# EAGLE design THW_Schematic_v1.0.0 (EAGLE 9.1.3)

## Sheet 1 of 2
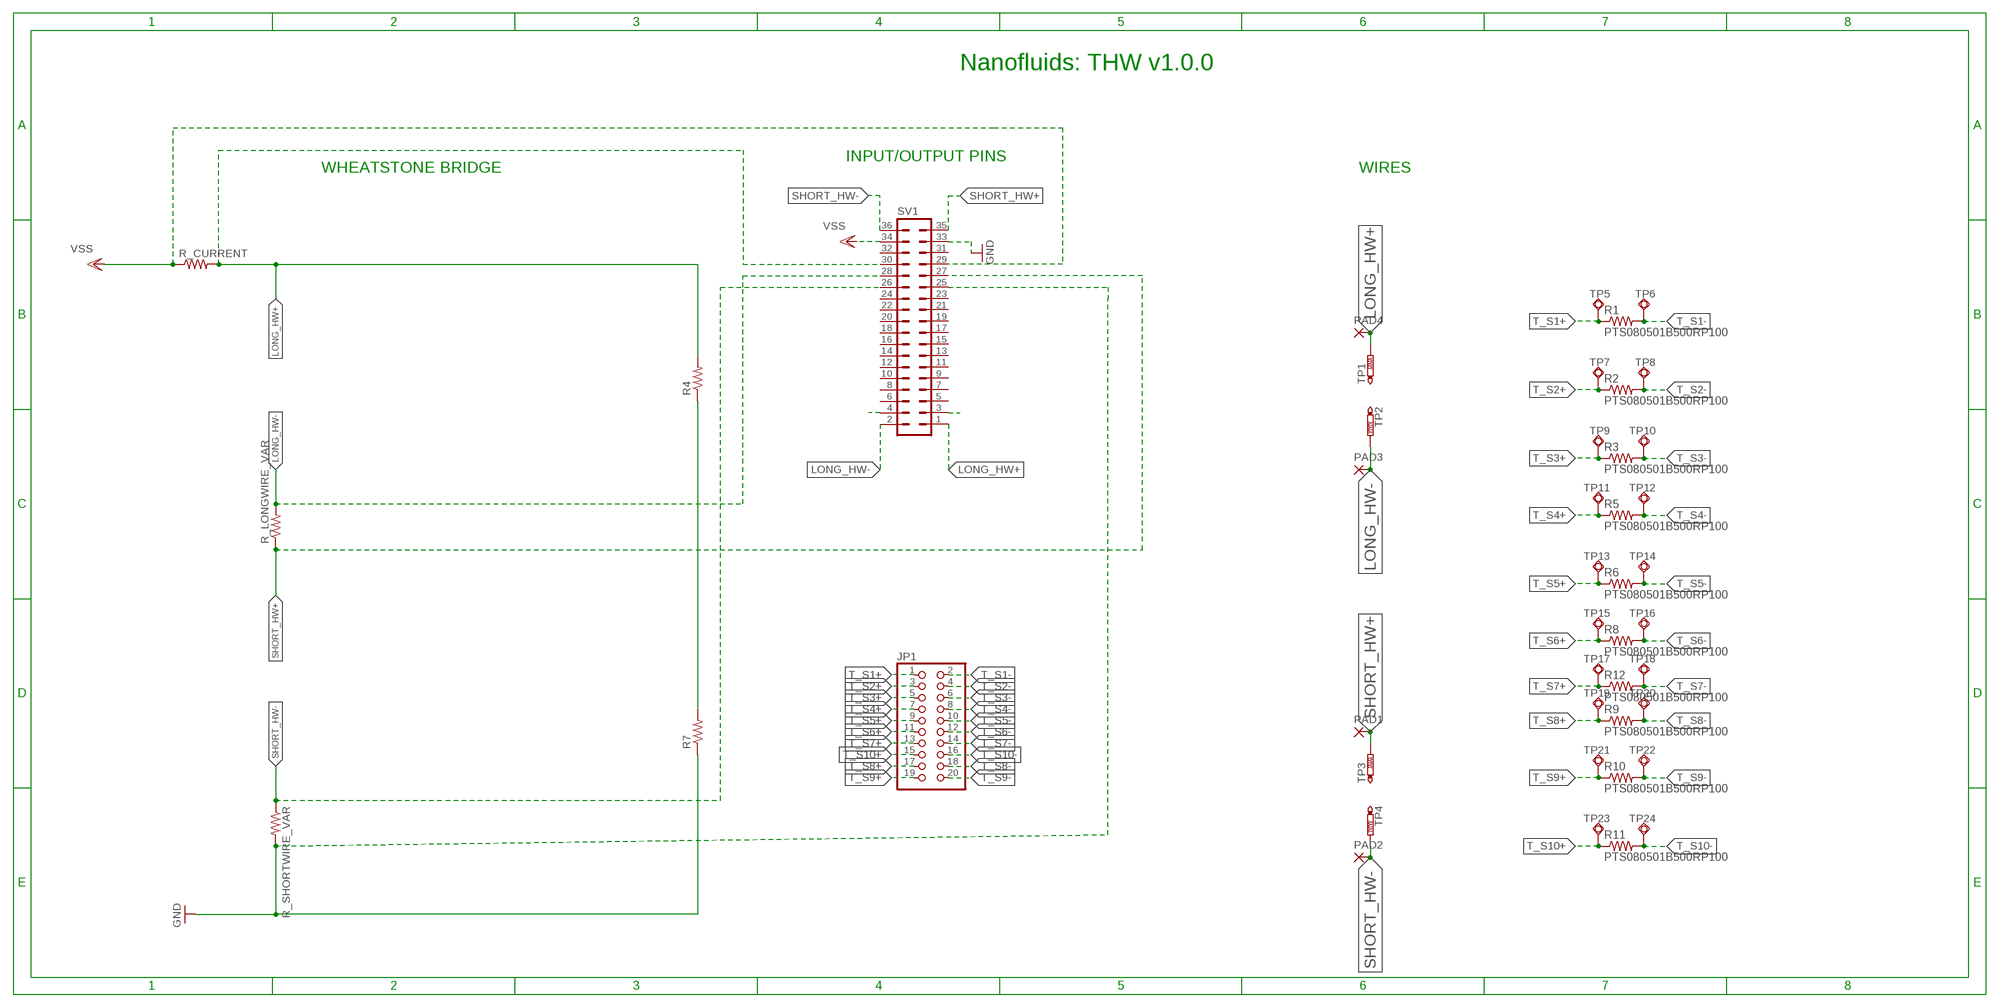
[diagram p0: schematic, sheet 1]

### Parts
JP1  PINHD-2X10  [2X10]
PAD1  SMD5  [SMD2,54-5,08]
PAD2  SMD5  [SMD2,54-5,08]
PAD3  SMD5  [SMD2,54-5,08]
PAD4  SMD5  [SMD2,54-5,08]
R1  PTS080501B500RP100  [RESC2012X60]
R2  PTS080501B500RP100  [RESC2012X60]
R3  PTS080501B500RP100  [RESC2012X60]
R4  R-US_M0805  [M0805]
R5  PTS080501B500RP100  [RESC2012X60]
R6  PTS080501B500RP100  [RESC2012X60]
R7  R-US_M0805  [M0805]
R8  PTS080501B500RP100  [RESC2012X60]
R9  PTS080501B500RP100  [RESC2012X60]
R10  PTS080501B500RP100  [RESC2012X60]
R11  PTS080501B500RP100  [RESC2012X60]
R12  PTS080501B500RP100  [RESC2012X60]
R_CURRENT  R-US_M0805  [M0805]
R_LONGWIRE_VAR  R-US_M0805  [M0805]
R_SHORTWIRE_VAR  R-US_M0805  [M0805]
SV1  MA18-2  [MA18-2]
TP1  PTR1TP20R  [TP20R]
TP2  PTR1TP20R  [TP20R]
TP3  PTR1TP20R  [TP20R]
TP4  PTR1TP20R  [TP20R]
TP5  TPSQTP09SQ  [TP09SQ]
TP6  TPSQTP09SQ  [TP09SQ]
TP7  TPSQTP09SQ  [TP09SQ]
TP8  TPSQTP09SQ  [TP09SQ]
TP9  TPSQTP09SQ  [TP09SQ]
TP10  TPSQTP09SQ  [TP09SQ]
TP11  TPSQTP09SQ  [TP09SQ]
TP12  TPSQTP09SQ  [TP09SQ]
TP13  TPSQTP09SQ  [TP09SQ]
TP14  TPSQTP09SQ  [TP09SQ]
TP15  TPSQTP09SQ  [TP09SQ]
TP16  TPSQTP09SQ  [TP09SQ]
TP17  TPSQTP09SQ  [TP09SQ]
TP18  TPSQTP09SQ  [TP09SQ]
TP19  TPSQTP09SQ  [TP09SQ]
TP20  TPSQTP09SQ  [TP09SQ]
TP21  TPSQTP09SQ  [TP09SQ]
TP22  TPSQTP09SQ  [TP09SQ]
TP23  TPSQTP09SQ  [TP09SQ]
TP24  TPSQTP09SQ  [TP09SQ]

### Nets
GND: R7.1 R_SHORTWIRE_VAR.2 SV1.25 SV1.33
LONG_HW+: PAD4.1(P) R4.2 R_CURRENT.2 SV1.1 SV1.30 TP1.TP
LONG_HW-: PAD3.1(P) R_LONGWIRE_VAR.2 SV1.2 SV1.28 TP2.TP
N$1: SV1.4
N$2: R4.1 R7.2
N$3: SV1.3
SHORT_HW+: PAD1.1(P) R_LONGWIRE_VAR.1 SV1.27 SV1.35 TP3.TP
SHORT_HW-: PAD2.1(P) R_SHORTWIRE_VAR.1 SV1.26 SV1.36 TP4.TP
T_S1+: JP1.1 R1.1 TP5.TP
T_S1-: JP1.2 R1.2 TP6.TP
T_S2+: JP1.3 R2.1 TP7.TP
T_S2-: JP1.4 R2.2 TP8.TP
T_S3+: JP1.5 R3.1 TP9.TP
T_S3-: JP1.6 R3.2 TP10.TP
T_S4+: JP1.7 R5.1 TP11.TP
T_S4-: JP1.8 R5.2 TP12.TP
T_S5+: JP1.9 R6.1 TP13.TP
T_S5-: JP1.10 R6.2 TP14.TP
T_S6+: JP1.11 R8.1 TP15.TP
T_S6-: JP1.12 R8.2 TP16.TP
T_S7+: R12.1 TP17.TP
T_S7-: JP1.14 R12.2 TP18.TP
T_S8+: JP1.17 R9.1 TP19.TP
T_S8-: JP1.18 R9.2 TP20.TP
T_S9+: JP1.19 R10.1 TP21.TP
T_S9-: JP1.20 R10.2 TP22.TP
T_S10+: JP1.15 R11.1 TP23.TP
T_S10-: JP1.16 R11.2 TP24.TP
VSS: R_CURRENT.1 SV1.29 SV1.34
Unconnected: JP1.13 SV1.5 SV1.6 SV1.7 SV1.8 SV1.9 SV1.10 SV1.11 SV1.12 SV1.13 SV1.14 SV1.15 SV1.16 SV1.17 SV1.18 SV1.19 SV1.20 SV1.21 SV1.22 SV1.23 SV1.24 SV1.31 SV1.32

### Notes on the sheet
- Nanofluids: THW v1.0.0
- INPUT/OUTPUT PINS
- WHEATSTONE BRIDGE | WIRES

## Sheet 2 of 2

## Library data of the parts
JP1 = pinhead:PINHD-2X10: PIN HEADER
PAD1-PAD4 = wirepad:SMD5: SMD PAD
R1-R3 R5 R6 R8-R12 = PTS080501B500RP100:PTS080501B500RP100: 500 OHM +/- .3OHM TOLERANCE; AVAILABILITY: Unavailable; DESCRIPTION: PTS Series 0805 500 Ohm Platinum Surface Mount Flat Chip Temperature Sensor; MF: Vishay; MP: PTS080501B500RP100; PACKAGE: 0805 Vishay; PRICE: None
R4 R7 R_CURRENT R_LONGWIRE_VAR R_SHORTWIRE_VAR = resistor:R-US_: RESISTOR, American symbol
SV1 = con-lstb:MA18-2: PIN HEADER; OC_FARNELL: unknown; OC_NEWARK: unknown
TP1-TP4 = testpad:PTR1: TEST PIN
TP5-TP24 = testpad:TPSQ: Test pad

## Board
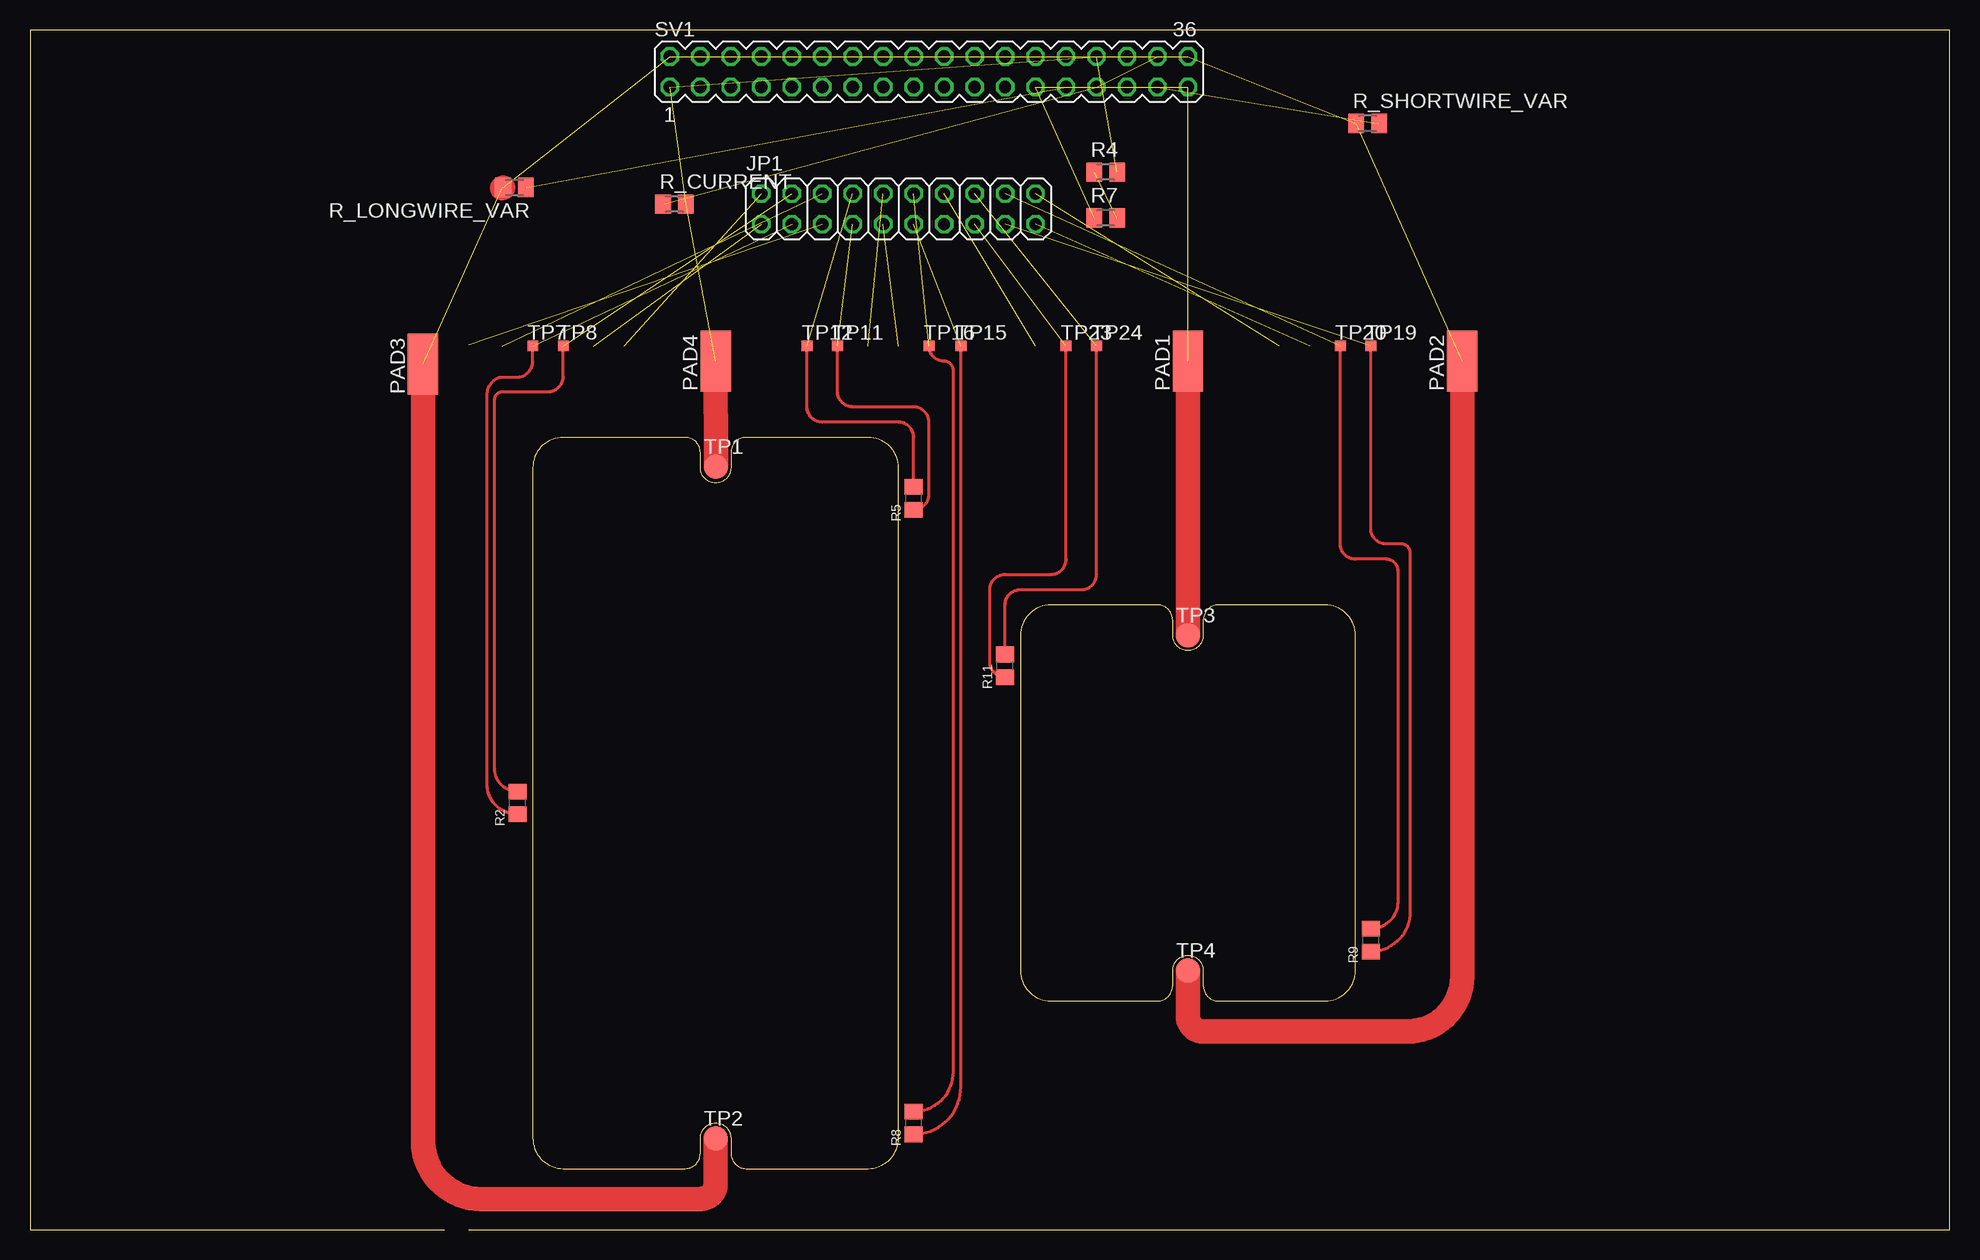
[diagram p1: board, top side]
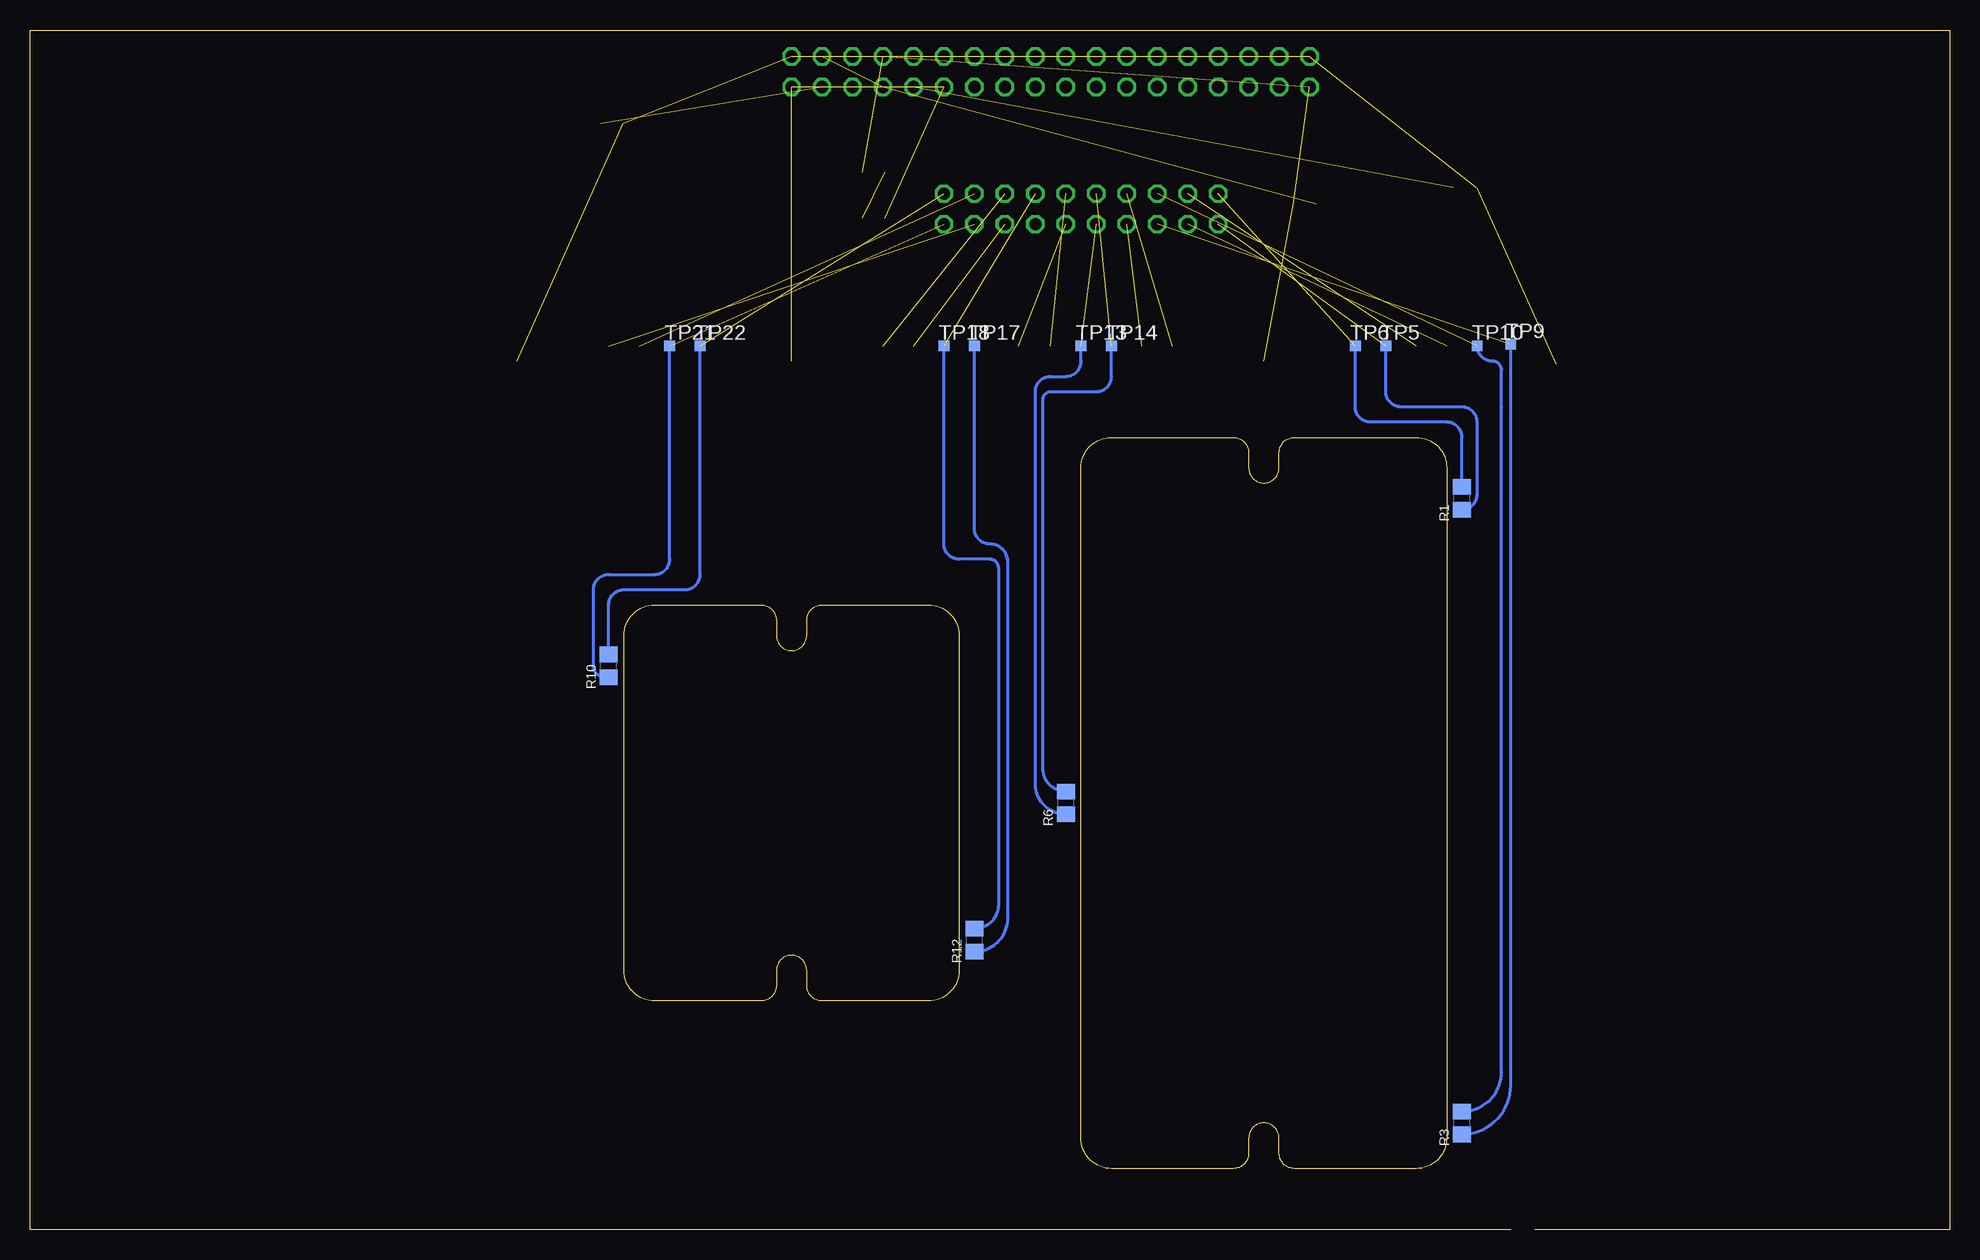
[diagram p2: board, bottom side, seen from below]

Size 160 x 100 mm. Coordinates in mm from the lower left corner, seen from the top.
Outline: 34.54,0 0,0 0,100 160,100 160,0 36.58,0
Copper layers (1*2*16): Top 0.035mm / dielectric 0.5138mm / Route2 0.035mm / dielectric 0.5138mm / Bottom 0.035mm
Design rules "default *": minimum track width 6mil, minimum drill 0.35mm, track to track 6mil, track to pad 6mil, pad to pad 6mil, via to via 6mil, smd to smd 6mil, copper to edge 40mil, drill to drill 6mil, minimum pad ring 10mil, minimum via ring 8mil, stop-mask expansion 4mil, vias tented up to drill 0mil, thermal gap 10mil
Milling: area 41.9,5.1 to 72.4,66; area 82.5,19.1 to 110.5,52.1

### Footprints (pad centres in the part's own frame; a part is rotated, then mirrored left to right if it is on the bottom)
2X10 = drill 1.016 octagon: 1 -11.43,-1.27; 2 -11.43,1.27; 3 -8.89,-1.27; 4 -8.89,1.27; 5 -6.35,-1.27; 6 -6.35,1.27; 7 -3.81,-1.27; 8 -3.81,1.27; 9 -1.27,-1.27; 10 -1.27,1.27; 11 1.27,-1.27; 12 1.27,1.27; 13 3.81,-1.27; 14 3.81,1.27; 15 6.35,-1.27; 16 6.35,1.27; 17 8.89,-1.27; 18 8.89,1.27; 19 11.43,-1.27; 20 11.43,1.27
SMD2,54-5,08 = smd 2.54 x 5.08: 1 0,0
RESC2012X60 = smd 1.3 x 1.5: 1 -0.95,0; 2 0.95,0
M0805 = smd 1.3 x 1.6: 1 -0.95,0; 2 0.95,0
MA18-2 = drill 1.016 octagon: 1 -21.59,-1.27; 2 -21.59,1.27; 3 -19.05,-1.27; 4 -19.05,1.27; 5 -16.51,-1.27; 6 -16.51,1.27; 7 -13.97,-1.27; 8 -13.97,1.27; 9 -11.43,-1.27; 10 -11.43,1.27; 11 -8.89,-1.27; 12 -8.89,1.27; 13 -6.35,-1.27; 14 -6.35,1.27; 15 -3.81,-1.27; 16 -3.81,1.27; 17 -1.27,-1.27; 18 -1.27,1.27; 19 1.27,-1.27; 20 1.27,1.27; 21 3.81,-1.27; 22 3.81,1.27; 23 6.35,-1.27; 24 6.35,1.27; 25 8.89,-1.27; 26 8.89,1.27; 27 11.43,-1.27; 28 11.43,1.27; 29 13.97,-1.27; 30 13.97,1.27; 31 16.51,-1.27; 32 16.51,1.27; 33 19.05,-1.27; 34 19.05,1.27; 35 21.59,-1.27; 36 21.59,1.27
TP20R = smd 2 x 2: TP 0,0
TP09SQ = smd 0.9 x 0.9: TP 0,0

### Placement (x,y rotation side)
JP1  72.39,85.09 0 top
PAD1  96.52,72.39 0 top
PAD2  119.38,72.39 0 top
PAD3  32.77,72.14 0 top
PAD4  57.15,72.39 0 top
R1  40.64,60.96 90 bottom
R2  40.64,35.56 90 top
R3  40.64,8.89 90 bottom
R4  89.66,88.14 0 top
R5  73.66,60.96 90 top
R6  73.66,35.56 90 bottom
R7  89.66,84.33 0 top
R8  73.66,8.89 90 top
R9  111.76,24.13 90 top
R10  111.76,46.99 90 bottom
R11  81.28,46.99 90 top
R12  81.28,24.13 90 bottom
R_CURRENT  53.72,85.47 0 top
R_LONGWIRE_VAR  40.39,86.87 180 top
R_SHORTWIRE_VAR  111.51,92.2 0 top
SV1  74.93,96.52 0 top
TP1  57.18,63.6 0 top
TP2  57.15,7.59 0 top
TP3  96.52,49.53 0 top
TP4  96.52,21.59 0 top
TP5  46.99,73.66 0 bottom
TP6  49.53,73.66 0 bottom
TP7  41.91,73.66 0 top
TP8  44.45,73.66 0 top
TP9  36.58,73.79 0 bottom
TP10  39.37,73.66 0 bottom
TP11  67.31,73.66 0 top
TP12  64.77,73.66 0 top
TP13  72.39,73.66 0 bottom
TP14  69.85,73.66 0 bottom
TP15  77.6,73.66 0 top
TP16  74.93,73.66 0 top
TP17  81.28,73.66 0 bottom
TP18  83.82,73.66 0 bottom
TP19  111.76,73.66 0 top
TP20  109.22,73.66 0 top
TP21  106.68,73.66 0 bottom
TP22  104.14,73.66 0 bottom
TP23  86.36,73.66 0 top
TP24  88.9,73.66 0 top

### Tracks (layer width: path | path; a pad name or v marks a point on that pad's centre or on a via)
GND  (3 unrouted)
LONG_HW+  (4 unrouted)
  Top 2.032: PAD4.1 57.17,63.61 TP1.TP
LONG_HW-  (3 unrouted)
  Top 2.032: 39.37,86.8 R_LONGWIRE_VAR.2 | TP2.TP 57.15,3.81 arc-90 55.88,2.54 37.59,2.54 arc-90 32.77,7.37 PAD3.1
N$2  (1 unrouted)
SHORT_HW+  (3 unrouted)
  Top 2.032: TP3.TP PAD1.1
SHORT_HW-  (3 unrouted)
  Top 2.032: TP4.TP 96.52,17.78 arc90 97.79,16.51 114.81,16.51 arc90 119.38,21.08 PAD2.1
T_S1+  (1 unrouted)
  Bottom 0.254: R1.1 arc-90 39.37,61.28 39.37,67.31 arc-90 40.64,68.58 45.72,68.58 arc90 46.99,69.85 TP5.TP
T_S1-  (1 unrouted)
  Bottom 0.254: R1.2 40.64,66.04 arc-90 41.91,67.31 48.26,67.31 arc90 49.53,68.58 TP6.TP
T_S2+  (1 unrouted)
  Top 0.254: R2.1 arc-90 38.1,37.15 38.1,69.34 | 38.1,69.34 38.1,69.47 | 38.1,69.34 38.1,69.6 arc-72 39.14,71.04 40.56,71.04 arc90 41.91,72.39 TP7.TP
T_S2-  (1 unrouted)
  Top 0.254: R2.2 arc-90 38.73,38.41 38.73,69.22 arc-90 39.37,69.85 43.18,69.85 arc90 44.45,71.12 TP8.TP
T_S3+  (1 unrouted)
  Bottom 0.254: R3.1 arc-90 36.58,12 36.58,71.25 TP9.TP
T_S3-  (1 unrouted)
  Bottom 0.254: R3.2 arc-90 37.34,13.14 37.34,68.58 37.34,71.63 arc-90 38.1,72.39 arc90 TP10.TP
T_S4+  (1 unrouted)
  Top 0.254: R5.1 arc90 74.93,61.28 74.93,67.31 arc90 73.66,68.58 68.58,68.58 arc-90 67.31,69.85 TP11.TP
T_S4-  (1 unrouted)
  Top 0.254: R5.2 73.66,66.04 arc90 72.39,67.31 66.04,67.31 arc-90 64.77,68.58 TP12.TP
T_S5+  (1 unrouted)
  Bottom 0.254: R6.1 arc90 76.2,37.15 76.2,69.85 arc90 74.93,71.12 73.66,71.12 arc-90 72.39,72.39 TP13.TP
T_S5-  (1 unrouted)
  Bottom 0.254: R6.2 arc90 75.56,38.41 75.56,69.22 arc90 74.93,69.85 71.12,69.85 arc-90 69.85,71.12 TP14.TP
T_S6+  (1 unrouted)
  Top 0.254: R8.1 arc90 77.6,11.88 TP15.TP
T_S6-  (1 unrouted)
  Top 0.254: R8.2 arc90 76.96,13.14 76.96,71.63 arc90 76.2,72.39 arc-90 TP16.TP
T_S7+
  Bottom 0.254: R12.1 arc-90 78.49,25.97 78.49,54.36 | 78.49,54.36 | 78.49,54.36 78.49,55.63 arc-90 80.01,57.15 arc90 81.28,58.42 TP17.TP
T_S7-  (1 unrouted)
  Bottom 0.254: R12.2 arc-90 79.25,27.11 79.25,55.12 arc-90 80.01,55.88 82.55,55.88 arc90 83.82,57.15 TP18.TP
T_S8+  (1 unrouted)
  Top 0.254: R9.1 arc90 115.06,26.48 115.06,56.39 arc90 114.3,57.15 113.03,57.15 arc-90 111.76,58.42 TP19.TP
T_S8-  (1 unrouted)
  Top 0.254: R9.2 arc90 114.05,27.37 114.05,54.61 114.05,54.86 arc90 113.03,55.88 | 113.03,55.88 arc90 113.03,55.88 | TP20.TP 109.22,57.15 arc90 110.49,55.88 113.03,55.88
T_S9+  (1 unrouted)
  Bottom 0.254: R10.1 112.08,46.04 arc90 113.03,46.99 113.03,53.34 arc90 111.76,54.61 107.95,54.61 arc-90 106.68,55.88 TP21.TP
T_S9-  (1 unrouted)
  Bottom 0.254: R10.2 111.76,52.07 arc90 110.49,53.34 107.95,53.34 | 107.95,53.34 | 107.95,53.34 105.41,53.34 arc-90 104.14,54.61 TP22.TP
T_S10+  (1 unrouted)
  Top 0.254: R11.1 arc-90 80.01,47.31 | 80.01,47.31 arc-90 80.01,47.31 | 80.01,47.31 80.01,53.34 arc-90 81.28,54.61 85.09,54.61 arc90 86.36,55.88 TP23.TP
T_S10-  (1 unrouted)
  Top 0.254: R11.2 81.28,52.07 arc-90 82.55,53.34 87.63,53.34 arc90 88.9,54.61 TP24.TP
VSS  (2 unrouted)

### Text on the board
Document: R = 0.0231 | R = 0.00210 | R = 0.00546 | R = 0.0183 | R = 0.130 | R = 0.128 | R = 0.0828 | R = 0.0820 | R = 0.0400 | R = 0.0374 | R = 0.0374 | R = 0.0400 | R = 0.0820 | R = 0.0827 | R = 0.128 | R = 0.130 | R = 0.103 | R = 0.102 | R = 0.0643 | R =0.0617 | R = 0.0617 | R = 0.0645 | R = 0.103 | R = 0.105